# EAGLE design Lightpack_6.0_man (EAGLE 6.2)
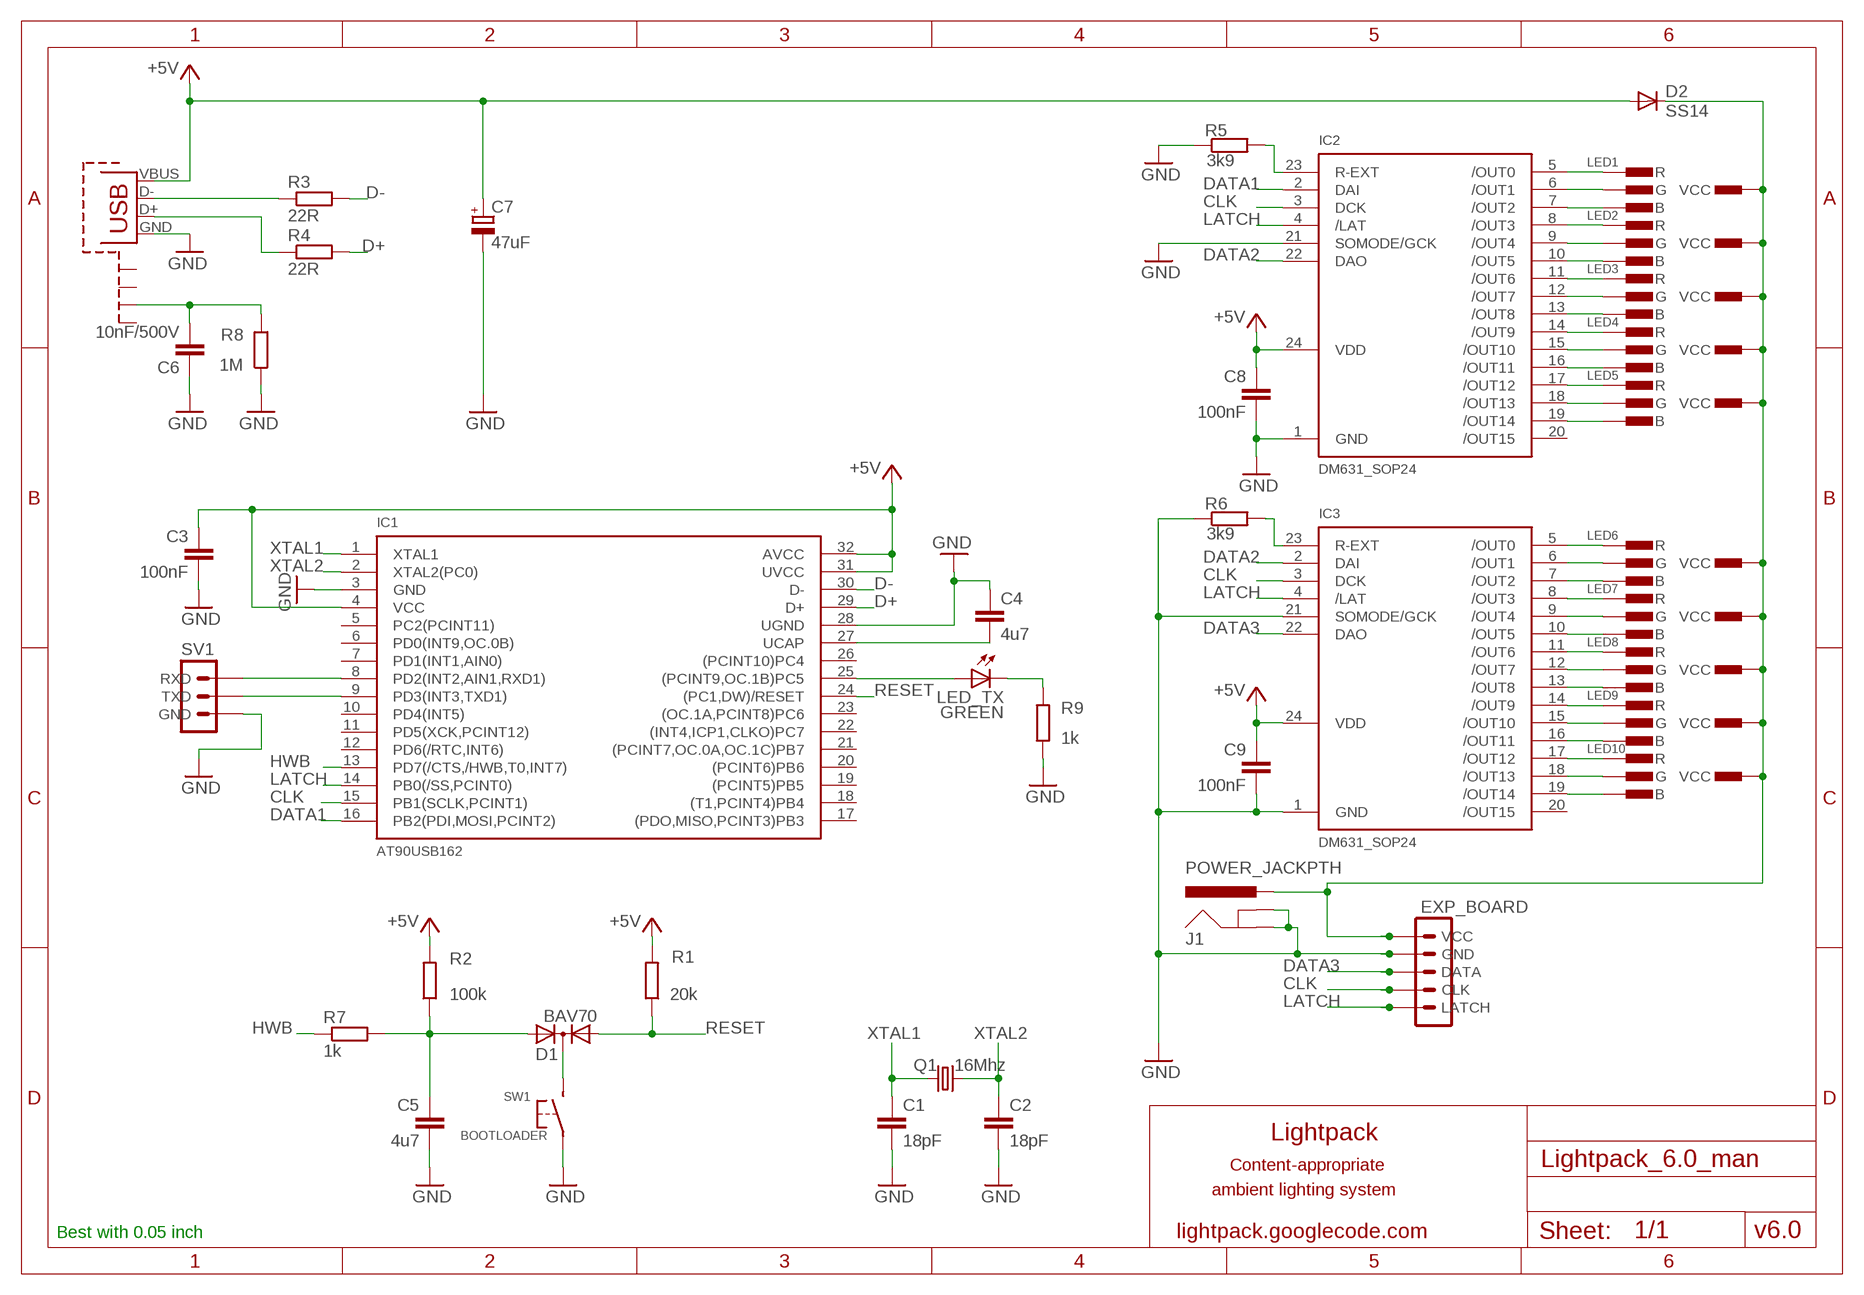
[diagram p0: schematic, sheet 1]

## Parts
C1  18pF  C-EUC0805  [C0805]
C2  18pF  C-EUC0805  [C0805]
C3  100nF  C-EUC0805  [C0805]
C4  4u7  C-EUC0805  [C0805]
C5  4u7  C-EUC0805  [C0805]
C6  10nF/500V  C-EUC0805  [C0805]
C7  47uF  CPOL-EUSMCD  [SMC_D]
C8  100nF  C-EUC0805  [C0805]
C9  100nF  C-EUC0805  [C0805]
D1  BAV70  DIODE-2AC|CASOT23  [SOT23]
D2  SS14  DIODE-SMB  [SMB]
EXP_BOARD  MA05-1  [MA05-1]
IC1  AT90USB162  [TQFP32]
IC2  DM631_SOP24  [SOP24-300-1.27]
IC3  DM631_SOP24  [SOP24-300-1.27]
J1  POWER_JACKPTH  [POWER_JACK_PTH]
LED1  CON-RGB-LED  CON-RGB-LED-TH  [CON-RGB-LED-TH]
LED2  CON-RGB-LED  CON-RGB-LED-TH  [CON-RGB-LED-TH]
LED3  CON-RGB-LED  CON-RGB-LED-TH  [CON-RGB-LED-TH]
LED4  CON-RGB-LED  CON-RGB-LED-TH  [CON-RGB-LED-TH]
LED5  CON-RGB-LED  CON-RGB-LED-TH  [CON-RGB-LED-TH]
LED6  CON-RGB-LED  CON-RGB-LED-TH  [CON-RGB-LED-TH]
LED7  CON-RGB-LED  CON-RGB-LED-TH  [CON-RGB-LED-TH]
LED8  CON-RGB-LED  CON-RGB-LED-TH  [CON-RGB-LED-TH]
LED9  CON-RGB-LED  CON-RGB-LED-TH  [CON-RGB-LED-TH]
LED10  CON-RGB-LED  CON-RGB-LED-TH  [CON-RGB-LED-TH]
LED_TX  GREEN  LEDCHIPLED_0805  [CHIPLED_0805]
Q1  16Mhz  CRYSTALHC49UP  [HC49UP]
R1  20k  R-EU_R0805  [R0805]
R2  100k  R-EU_R0805  [R0805]
R3  22R  R-EU_R0805  [R0805]
R4  22R  R-EU_R0805  [R0805]
R5  3k9  R-EU_R0805  [R0805]
R6  3k9  R-EU_R0805  [R0805]
R7  1k  R-EU_R0805  [R0805]
R8  1M  R-EU_R0805  [R0805]
R9  1k  R-EU_R0805  [R0805]
SV1  UART3  [UART3]
SW1  BOOTLOADER  BUTTON  [BUTTON-SMD]
X1  USB-MB-S  [USB-MB-S]

## Nets
+5V [VCC]: C3.1 C7.+ C8.1 C9.1 D2.A IC1.4(VCC) IC1.31(UVCC) IC1.32(AVCC) IC2.24(VDD) IC3.24(VDD) R1.2 R2.2 X1.VBUS
CLK: EXP_BOARD.2(CLK) IC1.15(PB1(SCLK,PCINT1)) IC2.3(DCK) IC3.3(DCK)
D+: IC1.29(D+) R4.2
D-: IC1.30(D-) R3.2
DATA1: IC1.16(PB2(PDI,MOSI,PCINT2)) IC2.2(DAI)
DATA2: IC2.22(DAO) IC3.2(DAI)
DATA3: EXP_BOARD.3(DATA) IC3.22(DAO)
GND: C1.2 C2.2 C3.2 C4.1 C5.2 C6.1 C7.- C8.2 C9.2 EXP_BOARD.4(GND) IC1.3(GND) IC1.28(UGND) IC2.1(GND) IC2.21(SOMODE/GCK) IC3.1(GND) IC3.21(SOMODE/GCK) J1.GND J1.GNDBREAK R5.1 R6.1 R8.1 R9.1 SV1.1-L(GND) SW1.1 X1.GND
HWB: IC1.13(PD7(/CTS,/HWB,T0,INT7)) R7.1
LATCH: EXP_BOARD.1(LATCH) IC1.14(PB0(/SS,PCINT0)) IC2.4(/LAT) IC3.4(/LAT)
N$1: IC2.23(R-EXT) R5.2
N$2: IC3.8(/OUT3) LED7.3.R(R)
N$3: IC1.8(PD2(INT2,AIN1,RXD1)) SV1.2(RXD)
N$4: IC1.9(PD3(INT3,TXD1)) SV1.3-R(TXD)
N$5: IC2.5(/OUT0) LED1.3.R(R)
N$6: IC2.6(/OUT1) LED1.2.G(G)
N$7: IC2.7(/OUT2) LED1.1.B(B)
N$8: IC1.25((PCINT9,OC.1B)PC5) LED_TX.A
N$9: IC2.8(/OUT3) LED2.3.R(R)
N$10: IC2.9(/OUT4) LED2.2.G(G)
N$11: IC2.10(/OUT5) LED2.1.B(B)
N$12: IC2.11(/OUT6) LED3.3.R(R)
N$13: IC2.12(/OUT7) LED3.2.G(G)
N$14: IC2.13(/OUT8) LED3.1.B(B)
N$15: IC2.14(/OUT9) LED4.3.R(R)
N$17: C4.2 IC1.27(UCAP)
N$18: IC3.5(/OUT0) LED6.3.R(R)
N$19: IC3.6(/OUT1) LED6.2.G(G)
N$20: IC3.7(/OUT2) LED6.1.B(B)
N$21: IC3.9(/OUT4) LED7.2.G(G)
N$22: IC3.10(/OUT5) LED7.1.B(B)
N$23: IC3.11(/OUT6) LED8.3.R(R)
N$24: IC3.12(/OUT7) LED8.2.G(G)
N$25: IC3.14(/OUT9) LED9.3.R(R)
N$26: IC3.13(/OUT8) LED8.1.B(B)
N$27: IC3.15(/OUT10) LED9.2.G(G)
N$28: IC3.16(/OUT11) LED9.1.B(B)
N$29: IC2.15(/OUT10) LED4.2.G(G)
N$30: IC2.16(/OUT11) LED4.1.B(B)
N$31: IC3.23(R-EXT) R6.2
N$32: R3.1 X1.D-
N$33: R4.1 X1.D+
N$37: LED_TX.C R9.2
N$38: IC2.17(/OUT12) LED5.3.R(R)
N$39: IC2.18(/OUT13) LED5.2.G(G)
N$40: IC2.19(/OUT14) LED5.1.B(B)
N$41: IC3.17(/OUT12) LED10.3.R(R)
N$42: IC3.18(/OUT13) LED10.2.G(G)
N$43: IC3.19(/OUT14) LED10.1.B(B)
N$44: C6.2 R8.2 X1.SHIELD3
N$45: D1.3(C) SW1.2
N$47: C5.1 D1.2(A2) R2.1 R7.2
N$57 [VCC]: D2.C EXP_BOARD.5(VCC) J1.PWR LED1.4.VCC(VCC) LED2.4.VCC(VCC) LED3.4.VCC(VCC) LED4.4.VCC(VCC) LED5.4.VCC(VCC) LED6.4.VCC(VCC) LED7.4.VCC(VCC) LED8.4.VCC(VCC) LED9.4.VCC(VCC) LED10.4.VCC(VCC)
RESET: D1.1(A1) IC1.24((PC1,DW)/RESET) R1.1
XTAL1: C1.1 IC1.1(XTAL1) Q1.1
XTAL2: C2.1 IC1.2(XTAL2(PC0)) Q1.2
Unconnected: IC1.5(PC2(PCINT11)) IC1.6(PD0(INT9,OC.0B)) IC1.7(PD1(INT1,AIN0)) IC1.10(PD4(INT5)) IC1.11(PD5(XCK,PCINT12)) IC1.12(PD6(/RTC,INT6)) IC1.17((PDO,MISO,PCINT3)PB3) IC1.18((T1,PCINT4)PB4) IC1.19((PCINT5)PB5) IC1.20((PCINT6)PB6) IC1.21((PCINT7,OC.0A,OC.1C)PB7) IC1.22((INT4,ICP1,CLKO)PC7) IC1.23((OC.1A,PCINT8)PC6) IC1.26((PCINT10)PC4) IC2.20(/OUT15) IC3.20(/OUT15) X1.SHIELD1 X1.SHIELD2 X1.SHIELD4

## Notes on the sheet
- Lightpack
- Content-appropriate
- ambient lighting system
- Best with 0.05 inch | lightpack.googlecode.com | v6.0

## Library data of the parts
C1-C6 C8 C9 = rcl:C-EU: CAPACITOR, European symbol
C7 = rcl:CPOL-EU: POLARIZED CAPACITOR, European symbol
D1 = diode:DIODE-2AC|CA: Dual DIODE Anode-Cathode|Cathode-Anode
D2 = diode:DIODE-: DIODE
EXP_BOARD = brd-conn:MA05-1: PIN HEADER
IC1 = AT90USB:AT90USB162: AT90USB162 Author: brunql.github.com
IC2 IC3 = _LedDrivers:DM631: DM631 Author: brunql.github.com
J1 = SparkFun:POWER_JACK: Power Jack This is the standard 5.5mm barrel jack for power. The PTH is the most common, proven, reliable, footprint. All others are experimental. The Slot footprint only works if the mill layer is transmitted to the PCB fab house so be warned. Spark Fun Electronics SKU : PRT-00119. Mating wall wart : TOL-00298 (and others)
LED1-LED10 = _led-rgb:CON-RGB-LED
LED_TX = led:LED: LED OSRAM: - CHIPLED LG R971, LG N971, LY N971, LG Q971, LY Q971, LO R971, LY R971 LH N974, LH R974 LS Q976, LO Q976, LY Q976 LO Q996 - Hyper CHIPLED LW Q18S LB Q993, LB Q99A, LB R99A - SideLED LS A670, LO A670, LY A670, LG A670, LP A670 LB A673, LV A673, LT A673, LW A673 LH A674 LY A675 LS A676, LA A676, LO A676, LY A676, LW A676 LS A679, LY A679, LG A679 - Hyper Micro SIDELED® LS Y876, LA Y876, LO Y876, LY Y876 LT Y87S - SmartLED LW L88C, LW L88S LB L89C, LB L89S, LG L890 LS L89K, LO L89K, LY L89K LS L896, LA L896, LO L896, LY L896 - TOPLED LS T670, LO T670, LY T670, LG T670, LP T670 LSG T670, LSP T670, LSY T670, LOP T670, LYG T670 LG T671, LOG T671, LSG T671 LB T673, LV T673, LT T673, LW T673 LH T674 LS T676, LA T676, LO T676, LY T676, LB T676, LH T676, LSB T676, LW T676 LB T67C, LV T67C, LT T67C, LS T67K, LO T67K, LY T67K, LW E67C LS E67B, LA E67B, LO E67B, LY E67B, LB E67C, LV E67C, LT E67C LW T67C LS T679, LY T679, LG T679 LS T770, LO T770, LY T770, LG T770, LP T770 LB T773, LV T773, LT T773, LW T773 LH T774 LS E675, LA E675, LY E675, LS T675 LS T776, LA T776, LO T776, LY T776, LB T776 LHGB T686 LT T68C, LB T68C - Hyper Mini TOPLED® LB M676 - Mini TOPLED Santana® LG M470 LS M47K, LO M47K, LY M47K Source: http://www.osram.convergy.de LUXEON: - LUMILED® LXK2-PW12-R00, LXK2-PW12-S00, LXK2-PW14-U00, LXK2-PW14-V00 LXK2-PM12-R00, LXK2-PM12-S00, LXK2-PM14-U00 LXK2-PE12-Q00, LXK2-PE12-R00, LXK2-PE12-S00, LXK2-PE14-T00, LXK2-PE14-U00 LXK2-PB12-K00, LXK2-PB12-L00, LXK2-PB12-M00, LXK2-PB14-N00, LXK2-PB14-P00, LXK2-PB14-Q00 LXK2-PR12-L00, LXK2-PR12-M00, LXK2-PR14-Q00, LXK2-PR14-R00 LXK2-PD12-Q00, LXK2-PD12-R00, LXK2-PD12-S00 LXK2-PH12-R00, LXK2-PH12-S00 LXK2-PL12-P00, LXK2-PL12-Q00, LXK2-PL12-R00 Source: www.luxeon.com KINGBRIGHT: KA-3528ASYC Source: www.kingbright.com
Q1 = crystal:CRYSTAL: CRYSTAL; OC_FARNELL: unknown; OC_NEWARK: unknown
R1-R9 = rcl:R-EU_: RESISTOR, European symbol
SV1 = _brd-conn:UART3: PIN HEADER
SW1 = button-smd:BUTTON: Button SMD
X1 = USB_miniB:USB: USB Connector miniUSB type B

## Net classes
1 VCC: width 0.6 mm, clearance 0.6 mm

## Board
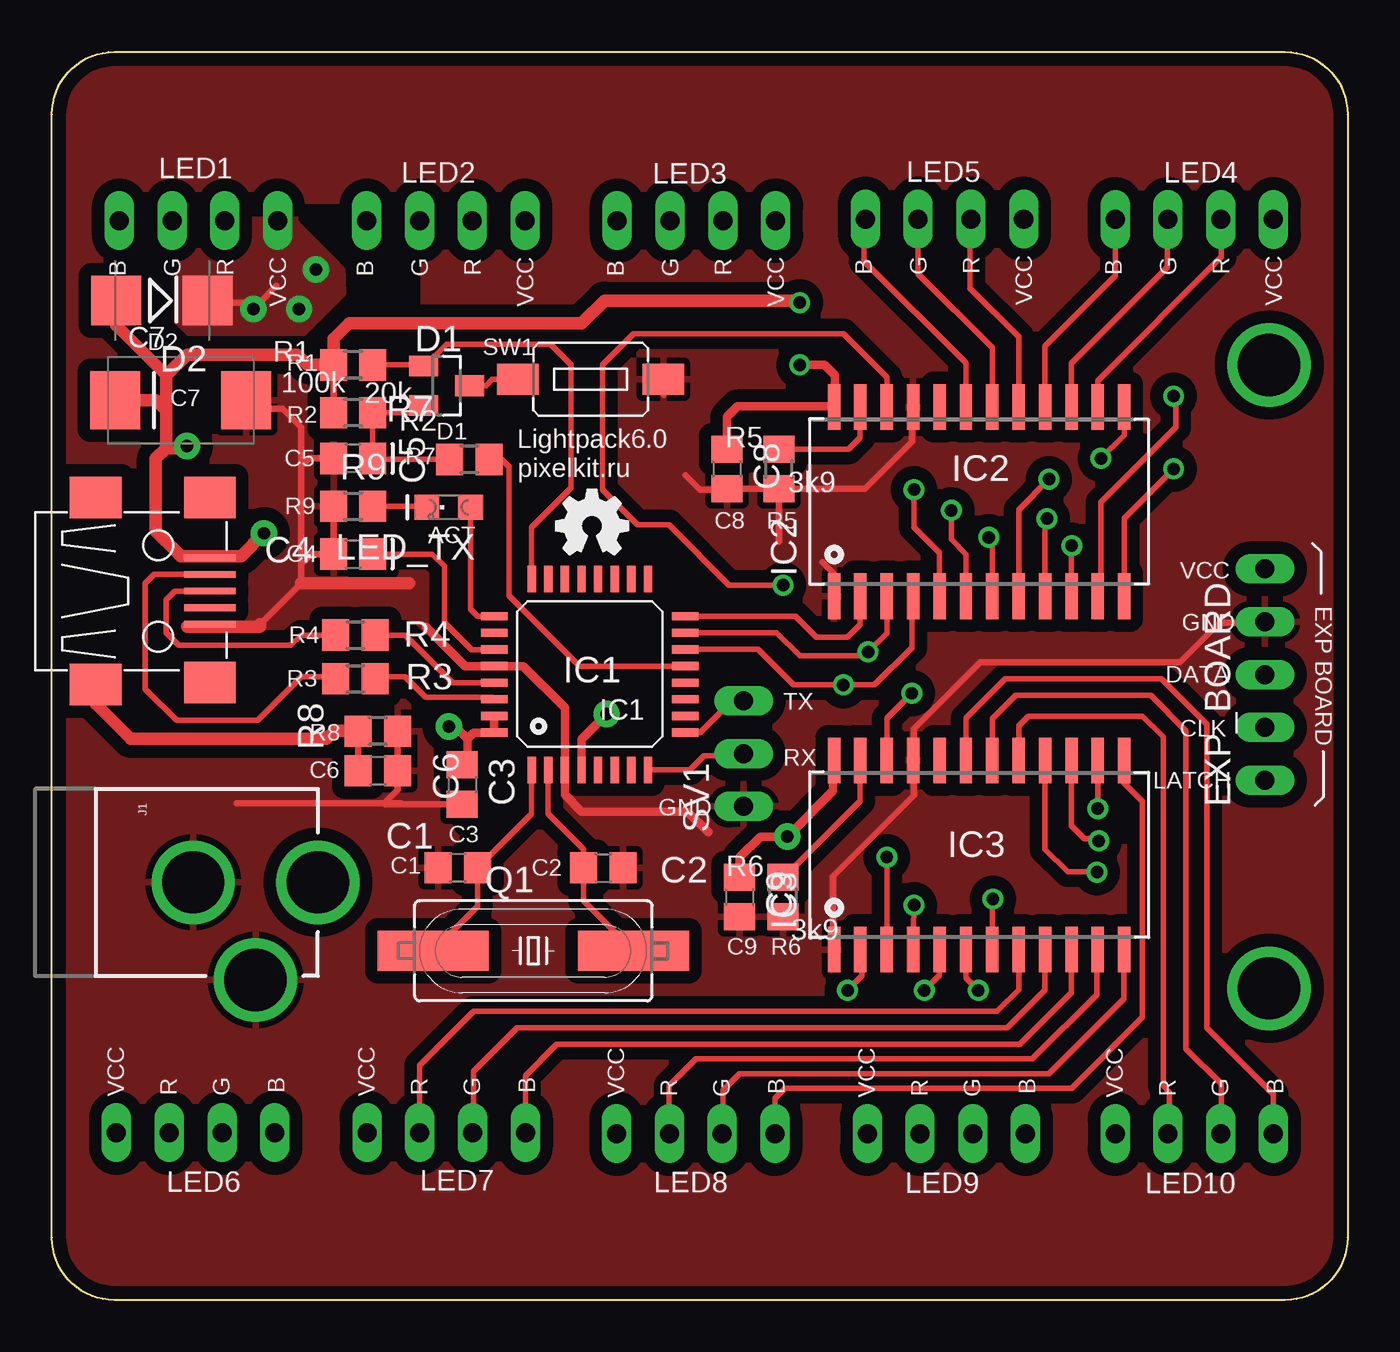
[diagram p1: board, top side]
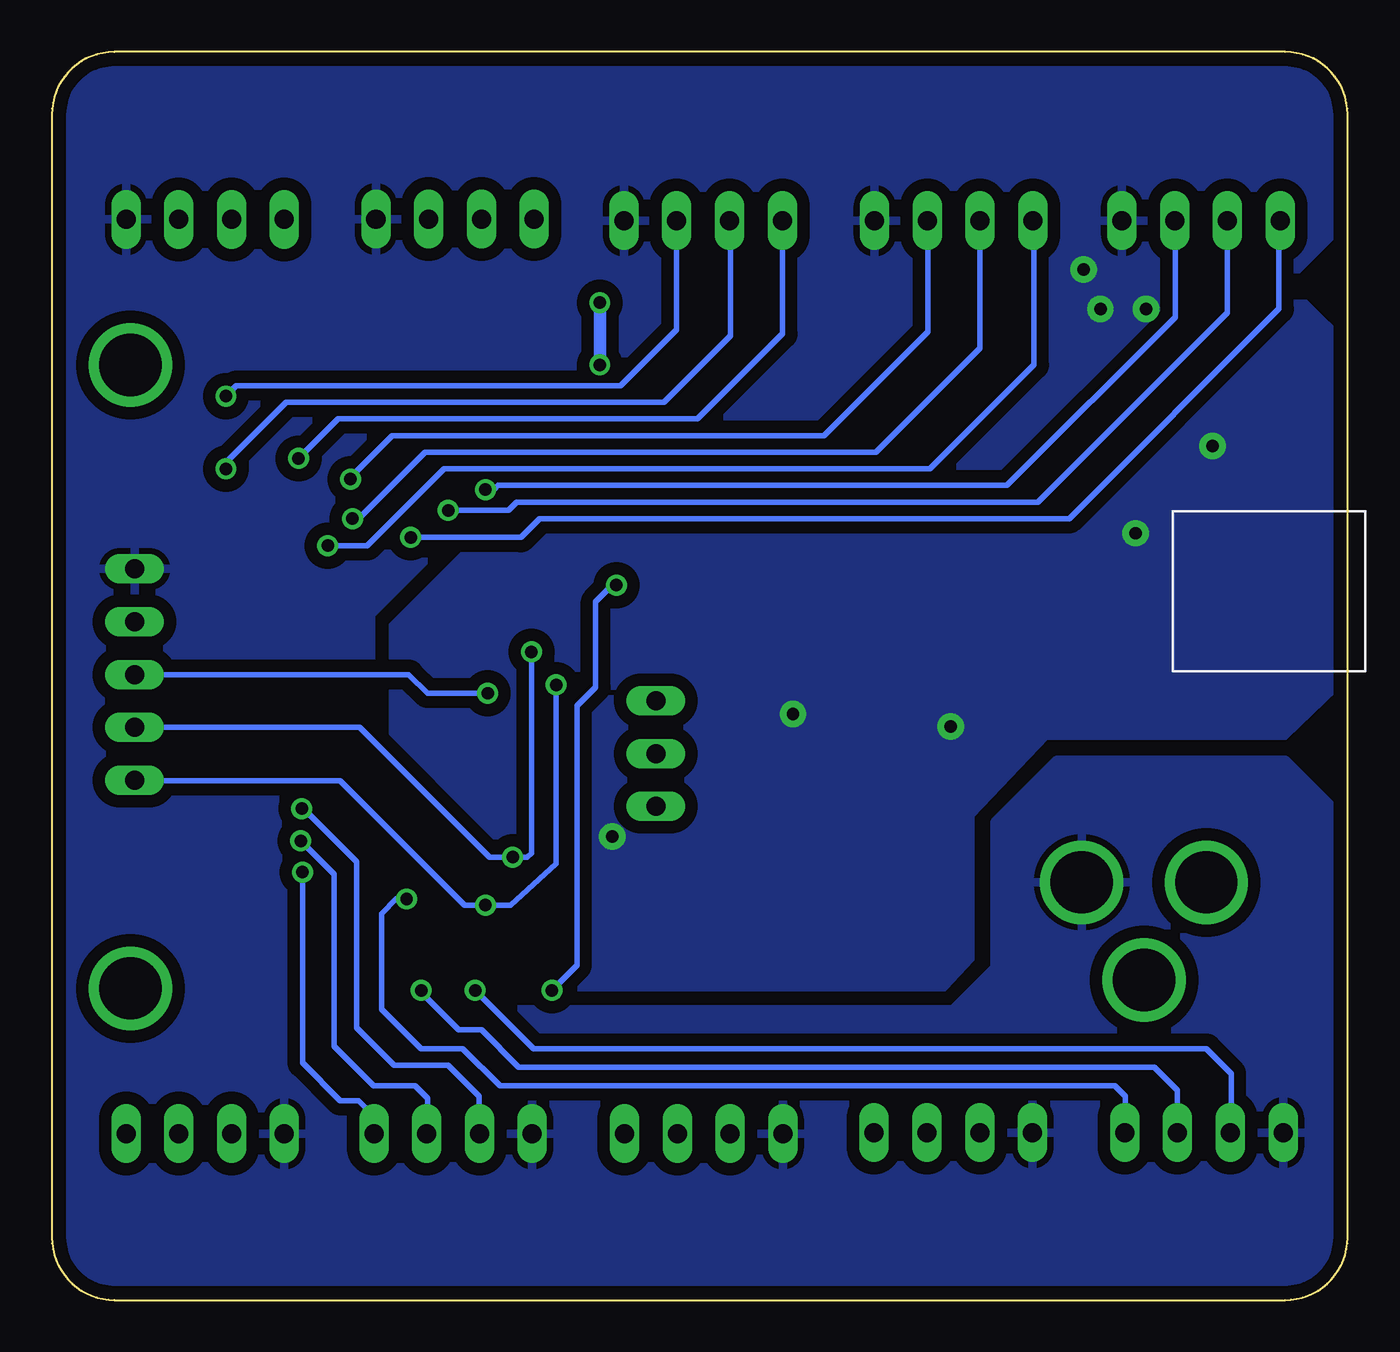
[diagram p2: board, bottom side, seen from below]

Size 62.38 x 60.06 mm. Coordinates in mm from the lower left corner, seen from the top.
Outline: 0,57.06 arc-90 3,60.06 59.38,60.06 arc-90 62.38,57.06 62.38,3 arc-90 59.38,0 3,0 arc-90 0,3 0,57.06
Copper layers (1*16): Top 0.035mm / dielectric 1.5mm / Bottom 0.035mm
Design rules: minimum track width 10mil, minimum drill 24mil, track to track 8mil, track to pad 8mil, pad to pad 8mil, via to via 8mil, smd to smd 8mil, copper to edge 25mil, drill to drill 8mil, minimum pad ring 10mil, minimum via ring 8mil, stop-mask expansion 4mil, vias tented up to drill 0mil, thermal gap 12mil
tRestrict: area 12,48 to 17,52; area 22,26 to 30,34; area 20,23 to 22,26; area 7,42.4 to 8,44.4

### Footprints (pad centres in the part's own frame; a part is rotated, then mirrored left to right if it is on the bottom)
C0805 = smd 1.3 x 1.5: 1 -0.95,0; 2 0.95,0
SMC_D = smd 2.4 x 2.8: + -3.15,0; - 3.15,0
SOT23 = smd 1 x 1.4: 1 -0.95,-1.1; 2 0.95,-1.1; 3 0,1.1
SMB = smd 2.4 x 2.4: A 2.2,0; C -2.2,0
MA05-1 = drill 0.914 long: 1 -5.08,0; 2 -2.54,0; 3 0,0; 4 2.54,0; 5 5.08,0
TQFP32 = smd 1.27 x 0.4: 1 -4.61,2.82; 2 -4.61,2.02; 3 -4.61,1.22; 4 -4.61,0.42; 5 -4.61,-0.38; 6 -4.61,-1.18; 7 -4.61,-1.98; 8 -4.61,-2.78; 17 4.59,-2.78; 18 4.59,-1.98; 19 4.59,-1.18; 20 4.59,-0.38; 21 4.59,0.42; 22 4.59,1.22; 23 4.59,2.02; 24 4.59,2.82 | smd 0.4 x 1.27: 9 -2.81,-4.58; 10 -2.01,-4.58; 11 -1.21,-4.58; 12 -0.41,-4.58; 13 0.39,-4.58; 14 1.19,-4.58; 15 1.99,-4.58; 16 2.79,-4.58; 25 2.79,4.62; 26 1.99,4.62; 27 1.19,4.62; 28 0.39,4.62; 29 -0.41,4.62; 30 -1.21,4.62; 31 -2.01,4.62; 32 -2.81,4.62
SOP24-300-1.27 = smd 0.6 x 2.2: 1 -6.85,-4.635; 2 -5.58,-4.635; 3 -4.31,-4.635; 4 -3.04,-4.635; 5 -1.77,-4.635; 6 -0.5,-4.635; 7 0.77,-4.635; 8 2.04,-4.635; 9 3.31,-4.635; 10 4.58,-4.635; 11 5.85,-4.635; 12 7.12,-4.635; 13 7.12,4.47; 14 5.85,4.47; 15 4.58,4.47; 16 3.31,4.47; 17 2.04,4.47; 18 0.77,4.47; 19 -0.5,4.47; 20 -1.77,4.47; 21 -3.04,4.47; 22 -4.31,4.47; 23 -5.58,4.47; 24 -6.85,4.47
POWER_JACK_PTH = drill 2.997: GND 0,7.7; GNDBREAK 4.7,10.7; PWR 0,13.7
CON-RGB-LED-TH = drill 0.914 long: 1.B 0,-3.81; 2.G 0,-1.27; 3.R 0,1.27; 4.VCC 0,3.81
CHIPLED_0805 = smd 1.2 x 1.2: A 0,-1.05; C 0,1.05
HC49UP = smd 5.334 x 1.93: 1 -4.826,0; 2 4.826,0
R0805 = smd 1.3 x 1.5: 1 -0.95,0; 2 0.95,0
UART3 = drill 0.914 long: 1-L -2.54,0; 2 0,0; 3-R 2.54,0
BUTTON-SMD = smd 2 x 1.5: 1 -3.5,0; 2 3.5,0
USB-MB-S = smd 2.5 x 0.32: D+ 2.5,0; D- 2.5,0.8; GND 2.5,-1.6; ID 2.5,-0.8; VBUS 2.5,1.6 | smd 2.5 x 2: SHIELD1 2.5,4.5; SHIELD2 -3,4.5; SHIELD3 -3,-4.5; SHIELD4 2.5,-4.4

### Placement (x,y rotation side)
C1  19.54,20.8 180 top
C2  26.54,20.8 0 top
C3  19.75,24.8 270 top
C4  14.5,35.9 0 top
C5  14.5,40.5 180 top
C6  15.7,25.46 180 top
C7  6.2,43.3 0 top
C8  32.5,40 270 top
C9  33.1,19.4 270 top
D1  19,44 270 top
D2  5.3,48.1 180 top
EXP_BOARD  58.4,30.1 90 top
IC1  25.91,30.12 90 top
IC2  44.5,38.5 0 top
IC3  44.5,21.5 0 top
J1  -0.9,20.1 270 top
LED1  7.05,51.94 270 top
LED2  18.96,51.94 270 top
LED3  31.02,51.94 270 top
LED4  55,52 270 top
LED5  42.97,52.02 270 top
LED6  6.92,8.06 90 top
LED7  18.98,8.06 90 top
LED8  31,8 90 top
LED9  43.06,8 90 top
LED10  55,8 90 top
LED_TX  19.1,38.15 90 top
Q1  23.18,16.81 0 top
R1  14.5,45 180 top
R2  14.5,42.7 180 top
R3  14.6,29.9 0 top
R4  14.6,32 0 top
R5  35,40 90 top
R6  35.2,19.4 90 top
R7  20.09,40.45 180 top
R8  15.7,27.38 180 top
R9  14.5,38.2 0 top
SV1  33.3,26.3 90 top
SW1  25.93,44.31 180 top
X1  5.11,34.12 0 top

### Tracks (layer width: path | path; a pad name or v marks a point on that pad's centre or on a via)
+5V  (via drill 0.6, 0.6 pad 1.27)
  Top 0.254: 6,36 6.1,36 6.4,35.7 7.59,35.7 X1.VBUS
  Top 0.305: R1.2 R2.2 | C3.1 20,26 | IC1.31 21.3,28.1 | 37.62,43 IC2.24 37.7,43.02 | 3.1,46.9 D2.A | 6.4,41 v6.5,41.1
  Top 0.406: IC1.31 IC1.32 20.31,27.31 20,27 | 20,26 20,27 | v19.1,27.6 19.5,27.5 20,27 | C8.1 32.5,42.5 33,43 37.62,43 | v36,45 37.2,45 37.7,44.5 37.7,43.02 | IC1.4 25.5,27 v26.7,28.2 | 37.62,26 IC3.24 37.6,25.92 37.6,24.5 v35.4,22.3 34.1,22.3 33.1,21.3 C9.1
  Top 0.61: 5.5,42.8 5,43.3 C7.+ | 5.5,42.8 5.5,44.5 | 5.5,44.5 6.5,45.5 11.8,45.5 12.3,45 R1.2 13.55,46.25 14.3,47 25.5,47 26.6,48.1 35.9,48.1 v36,48 | 5.5,44.5 3.1,46.9 | 5,37.1 5,40.5 5.5,41 | 5.5,41 5.5,42.8 | 5.5,41 6.4,41 | v10.2,36.9 9.1,35.8 6.2,35.8 6,36 5,37
  Bottom 0.61: v36,48 v36,45
  pour Bottom: 2,48 0,46 0,30 3,27.1 14.5,27.1 18.1,23.3 18.1,16.4 19.4,15 45,15 46,16 46,32.5 41.5,37 13.7,37 2.8,48
CLK  (via drill 0.6)
  Top 0.254: IC3.3 v40.19,21.31 | IC1.15 34.89,32.11 36,31 39.1,31 v39.29,31.19 40.19,32.09 IC2.3
  Top 0.305: IC2.3 40.19,34.69
  Bottom 0.254: v39.29,31.19 39.29,21.51 39.5,21.3 v40.18,21.3 v40.19,21.31 v40.2,21.3 41.3,21.3 47.56,27.56 EXP_BOARD.2
D+
  Top 0.254: IC1.29 19.3,29.7 17,32 R4.2
  Top 0.305: IC1.29
D-
  Top 0.254: IC1.30 21.2,29 18,29 17,30 15.65,30 R3.2
DATA1
  Top 0.254: IC1.16 35.79,32.91 36.8,31.9 38.3,31.9 38.9,32.5 38.9,33.84
  Top 0.305: 38.9,33.84 IC2.2
DATA2  (via drill 0.6)
  Top 0.254: IC2.22 40.19,44.41 38.1,46.5 28,46.5 26.5,45 26.5,39 28.2,37.3 29.7,37.3 32.6,34.4 v35.2,34.4 | 39,16.79 39,15.6 v38.3,14.9
  Top 0.305: 38.92,16.92 IC3.2 39,16.79
  Bottom 0.254: v38.3,14.9 37.1,16.1 37.1,28.6 36.2,29.5 36.2,33.6 35.4,34.4 v35.2,34.4
DATA3  (via drill 0.6)
  Top 0.254: IC3.22 40.19,27.99 v41.4,29.2
  Bottom 0.254: v41.4,29.2 44.3,29.2 45.2,30.1 EXP_BOARD.3
GND
  Top 0.254: 6.5,32.4 7.49,32.4 X1.GND
  Top 0.305: 9,44 C7.- 8.6,42.9 11.1,42.9 12,42 12,40.1 | R8.1 C6.1 16.65,24.55 16,23.9 | 29.43,43.56 SW1.1 | 8.9,23.9 16,23.9 | 16,23.9 16.8,23.9 | 16,23.9 16.05,23.85 C3.2 19.8,23.8 | R9.1 C4.1 12.5,35.9 12,35.4 | EXP_BOARD.4 58.96,32.6 56.2,32.6 54.3,30.7 44.7,30.7 41.5,27.5 41.5,25.93 | IC3.1 37.6,16.91 37.6,20.4 41.5,24.3 41.5,25.93 | 41.5,25.93 IC3.21 | 30.5,39.7 31.2,39 32.45,39 C8.2 R5.1 | 37.1,35.5 37.6,35 37.6,33.91 IC2.1 | R5.1 35,36.5 | R5.1 39.15,39.05 41.4,41.3 41.4,42.91 IC2.21 | 10.02,32.52 12,34.5 12,35.4 | 12,35.4 12,40.1 | C5.2 12.4,40.5 12,40.1 | IC1.3
  Top 0.406: IC1.3 24.7,24.3 25.5,23.5 30.6,23.5 31.6,22.5 | 18,32.4 19.89,30.51 IC1.28 22.69,30.51 24.7,28.5 IC1.3
  Top 0.61: 12,34.5 17.2,34.5 | 10.02,32.52 10.02,32.42 10,32.4 6.5,32.4
  pour Top (isolate 0.61): 0,60 62,60 62,0 0,0
HWB
  Top 0.254: IC1.13 25.4,30.5 22,33.9 22,40.1 21.65,40.45 R7.1
  Top 0.305: IC1.13
LATCH  (via drill 0.6)
  Top 0.254: IC3.4 41.5,18.91 | IC1.14 33.99,31.31 35.7,29.6 v38.1,29.6 39.6,29.6 41.4,31.4 41.4,33.8
  Top 0.305: 41.5,18.91 v41.5,19 | 41.5,33.6 41.5,34.42 41.46,34.46 IC2.4 41.4,33.8
  Bottom 0.254: v38.1,29.6 38.1,21 40.3,19 v41.5,19 42.5,19 48.5,25 58.38,25 EXP_BOARD.1
N$1
  Top 0.254: R5.2 38.35,40.95 38.9,41.5 38.9,42.95
  Top 0.305: 38.9,42.95 IC2.23
N$2
  Top 0.254: IC3.8 46.54,14.94 45.5,13.9 20.3,13.9 17.7,11.3 LED7.3.R
  Top 0.305: LED7.3.R
N$3
  Top 0.254: IC1.8 30.71,25.51 31.4,26.2 33.2,26.2 SV1.2
N$4
  Top 0.254: IC1.9 31.21,27.31 32.7,28.8 33.26,28.8 SV1.3-R
N$5  (via drill 0.6)
  Top 0.254: IC2.5 42.73,35.97 41.5,37.2 v41.5,39
  Bottom 0.254: v41.5,39 41.1,39 40.9,39.2 16.4,39.2 8.3,47.3 8.3,51.92
  Bottom 0.305: 8.3,51.92 LED1.3.R
N$6  (via drill 0.6)
  Top 0.254: IC2.6 44,35.9 43.3,36.6 v43.3,38
  Bottom 0.254: LED1.2.G 5.8,51.93 5.8,47.5 14.9,38.4 40,38.4 40.4,38 v43.3,38
N$7  (via drill 0.6)
  Top 0.254: IC2.7 45.27,36.53 v45.1,36.7
  Bottom 0.254: LED1.1.B 3.3,51.89 3.3,47.7 13.4,37.6 38.9,37.6 39.8,36.7 v45.1,36.7
N$8
  Top 0.254: LED_TX.A 20.15,33.25 20.5,32.9 IC1.25
  Top 0.305: IC1.25
N$9  (via drill 0.6)
  Top 0.254: IC2.8 46.54,38.04 v48,39.5
  Bottom 0.254: v48,39.5 48,39.6 46,41.6 25.2,41.6 20.2,46.6 20.2,51.91 LED2.3.R
N$10  (via drill 0.6)
  Top 0.254: 47.81,37.51 IC2.9
  Top 0.305: v47.9,37.6 47.81,37.51
  Bottom 0.254: v47.9,37.6 47.6,37.6 44.4,40.8 22.7,40.8 17.7,45.8 LED2.2.G
N$11  (via drill 0.6)
  Top 0.254: 49.08,36.28 IC2.10
  Top 0.305: IC2.10 49.08,33.58 | v49.1,36.3 49.08,36.28
  Bottom 0.254: v49.1,36.3 47.2,36.3 43.5,40 20.1,40 15.1,45 15.1,51.89 LED2.1.B
N$12  (via drill 0.6)
  Top 0.254: 50.5,34.5 50.5,38.4 54.1,42 54.1,43.4 v54,43.5
  Top 0.305: IC2.11 50.35,34.65 50.5,34.5
  Bottom 0.254: LED3.3.R 32.3,46.7 35,44 53.5,44 v54,43.5
  Bottom 0.305: LED3.3.R
N$13  (via drill 0.6)
  Top 0.254: IC2.12 51.62,37.62 v54,40
  Bottom 0.254: v54,40 54,40.3 51.1,43.2 32.9,43.2 29.7,46.4 29.7,51.89 LED3.2.G
N$14  (via drill 0.6)
  Top 0.254: IC2.13 51.62,41.62 v50.5,40.5
  Bottom 0.254: v50.5,40.5 48.6,42.4 31.3,42.4 27.2,46.5 27.2,51.93 LED3.1.B
N$15
  Top 0.254: IC2.14 50.35,44.25 56.3,50.2 56.3,51.97 LED4.3.R
N$17
  Top 0.254: IC1.27 20.2,31.3 18.9,32.6 18.9,35.3 18.3,35.9 C4.2
  Top 0.305: IC1.27
N$18  (via drill 0.6)
  Top 0.254: IC3.5 42.73,15.63 v42,14.9
  Bottom 0.254: v42,14.9 39.2,12.1 6.8,12.1 5.6,10.9 5.6,8.1 LED6.3.R
N$19  (via drill 0.6)
  Top 0.254: IC3.6 44,15.5 v44.6,14.9
  Bottom 0.254: LED6.2.G 8.2,8.07 8.2,10.1 9.3,11.2 39.9,11.2 41.7,13 42.8,13 44.6,14.8 v44.6,14.9
N$20  (via drill 0.6)
  Top 0.254: 45.27,19.27 IC3.7
  Top 0.305: IC3.7 45.27,16.27 | v45.3,19.3 45.27,19.27
  Bottom 0.254: v45.3,19.3 45.8,19.3 46.5,18.6 46.5,14 44.6,12.1 42.6,12.1 40.8,10.3 11.2,10.3 10.7,9.8 10.7,8.08
  Bottom 0.305: LED6.1.B 10.7,8.08
N$21
  Top 0.254: IC3.9 47.81,14.91 46,13.1 22.4,13.1 20.3,11 20.3,8.11
  Top 0.305: LED7.2.G 20.3,8.11
N$22
  Top 0.254: IC3.10 49.08,14.78 46.6,12.3 24.3,12.3 22.8,10.8 LED7.1.B
N$23
  Top 0.254: 50.3,16.82 50.3,14.7 47.2,11.6 31,11.6 29.7,10.3 29.7,8.03 LED8.3.R
  Top 0.305: 50.35,16.85 IC3.11 50.3,16.82
N$24
  Top 0.254: 51.6,16.84 51.6,14.5 48,10.9 33.1,10.9 32.3,10.1 32.3,8.04 LED8.2.G
  Top 0.305: 51.62,17.12 IC3.12 51.6,16.84
N$25  (via drill 0.6)
  Top 0.254: v50.35,23.65 IC3.14
  Bottom 0.254: 50.25,23.65 47.7,21.1 47.7,13.1 45.9,11.3 43.3,11.3 41.8,9.8 41.8,8.01 LED9.3.R
  Bottom 0.305: 50.25,23.65 v50.35,23.65
N$26
  Top 0.254: 51.62,24.88 52.5,24 52.5,13.6 49.1,10.2 35.3,10.2 34.8,9.7 LED8.1.B
  Top 0.305: 51.62,24.88 IC3.13 | LED8.1.B
N$27  (via drill 0.6)
  Top 0.254: IC3.15 49.08,22.82 49.7,22.2 50.3,22.2 v50.4,22.1
  Bottom 0.254: v50.4,22.1 48.8,20.5 48.8,12.2 46.9,10.3 44.9,10.3 44.3,9.7 44.3,8.03 LED9.2.G
N$28  (via drill 0.6)
  Top 0.254: IC3.16 47.81,21.69 48.9,20.6 v50.3,20.6 v50.31,20.59
  Bottom 0.254: v50.31,20.59 50.31,11.41 48.5,9.6 47.6,9.6 46.9,8.9 46.9,8.03
  Bottom 0.305: LED9.1.B 46.9,8.03
N$29
  Top 0.254: IC2.15 49.08,45.08 53.7,49.7 53.7,51.97 LED4.2.G
N$30
  Top 0.254: IC2.16 47.81,45.91 51.2,49.3 LED4.1.B
N$31
  Top 0.254: R6.2 35.25,20.35 38.9,24 38.9,25.95
  Top 0.305: 38.92,26.92 IC3.23 38.9,25.95
N$32
  Top 0.254: X1.D- 4.92,34.92 4.5,34.5 4.5,29.4 6,27.9 9.9,27.9 12,30 13.55,30 R3.1
N$33
  Top 0.254: X1.D+ 5.92,34.12 5.5,33.7 5.5,32.1 6.1,31.5 11.5,31.5 12,32 R4.1
N$34  (via drill 3)
  other vias: 58.6,45
N$35  (via drill 3)
  other vias: 58.6,15
N$37
  Top 0.254: R9.2 18,38.2
  Top 0.305: 18,38.2 LED_TX.C
N$38
  Top 0.254: IC2.17 46.54,46.36 44.2,48.7 44.2,51.98 LED5.3.R
N$39
  Top 0.254: IC2.18 45.27,45.83 41.7,49.4 LED5.2.G
N$40
  Top 0.254: IC2.19 44,45.1 39.1,50 39.1,51.96 LED5.1.B
N$41
  Top 0.254: IC3.17 46.54,27.64 47,28.1 52.5,28.1 53.5,27.1 53.5,10.3 53.8,10 53.8,8.07 LED10.3.R
N$42
  Top 0.254: IC3.18 45.27,27.97 46.4,29.1 52.9,29.1 54.6,27.4 54.6,12.1 56.3,10.4 56.3,8.03 LED10.2.G
N$43
  Top 0.254: IC3.19 44,28 45.9,29.9 53.4,29.9 55.6,27.7 55.6,13.1 58.8,9.9 58.8,8.01 LED10.1.B
N$44
  Top 0.305: C6.2 R8.2 14.72,27.4 | 2.1,28.7 X1.SHIELD3
  Top 0.61: 14.72,27.4 13.6,27.4 13.2,27 3.8,27 2.1,28.7
N$45
  Top 0.254: D1.3 20.9,44 21.2,44.3 SW1.2
N$47
  Top 0.254: C5.1 R2.1 17.55,42.7 | 15.5,40.45 R7.2
  Top 0.305: 17.55,42.7 D1.2 | C5.1 15.5,40.45
N$57  (via drill 0.6 pad 1.27)
  Top 0.305: 10.8,48.8 10,48 7.6,48 D2.C
  other vias: 12.7,49.6 11.9,47.7 9.7,47.7
  pour Top (no thermals): 6,49 7,52 13,52 13.93,50.51 arc-75 13.97,50.43 14.04,48.44 13.96,48.36 12.1,46.5 6.6,46.5 6,47.1
  pour Bottom (isolate 0.406): 0,52 0,60 62,60 62,0 0,0 0,23 3,26 14,26 17,23 17,16 19,14 44,14 47,17 47,33 44,36 16,36
RESET
  Top 0.254: 17.85,45 R1.1 | D1.1 17.95,44.95 19,46 24,46 25,45 25,39.1 23.1,37.2 23.1,35.71 IC1.24
  Top 0.305: D1.1 17.85,45
XTAL1
  Top 0.254: IC1.1 23.09,23.41 C1.1 20.48,18.94 Q1.1
XTAL2
  Top 0.254: IC1.2 23.89,23.41 25.6,21.7 C2.1 25.59,19.22 Q1.2

### Text on the board
tPlace: D2 | R1 | C7 | R2 | D1 | Lightpack6.0 | C5 | R7 | pixelkit.ru | IC2 | R9 | C8 | R5 | C4 | ACT | VCC | EXP BOARD | R4 | GND | R3 | IC1 | DATA | TX | R8 | CLK | RX | C6 | LATCH | GND | C3 | IC3 | C1 | C2 | C9 | R6
tTest: C:/Users/Panda/Desktop/Untitled-1.bmp | C:/Users/Panda/Desktop/Untitled-1.bmp | C:/Users/Panda/Desktop/Untitled-1.bmp